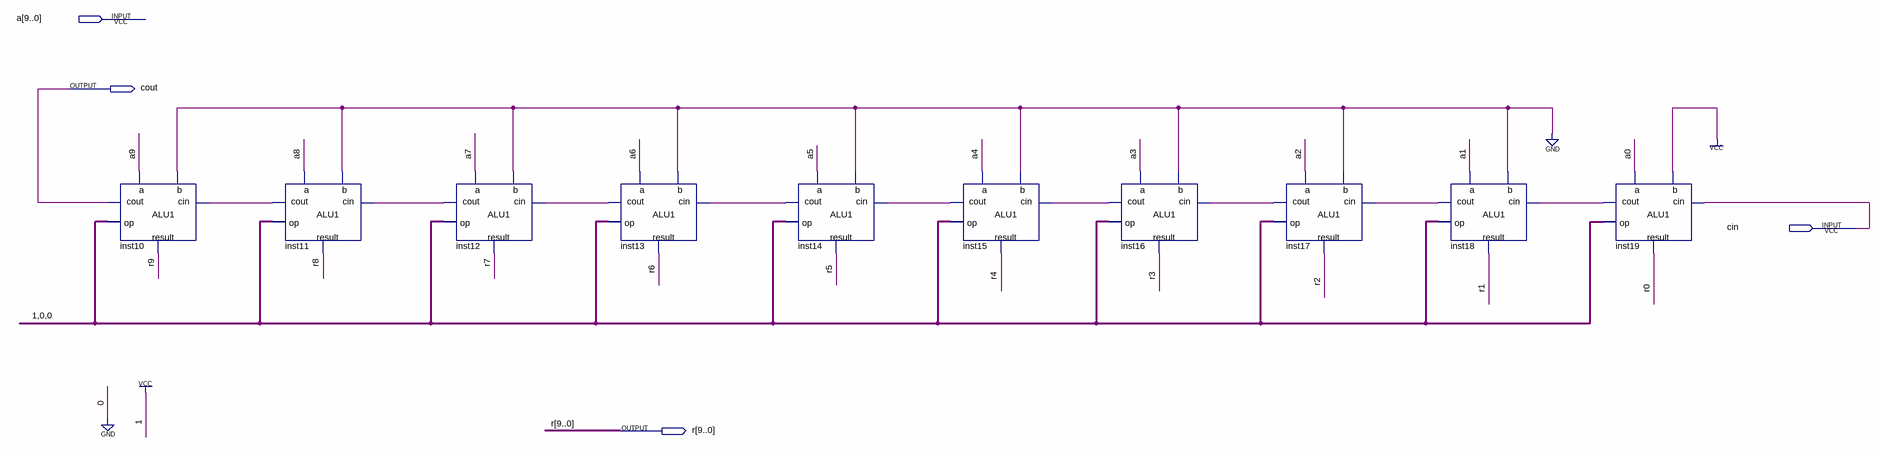
[diagram p0: schematic sheet]
// Quartus schematic inc10.bdf as structural Verilog: 10 symbols, 4 pins
module inc10 (
  input  [9:0] a,
  input  cin,
  output cout,
  output [9:0] r
);

  wire inst11_cout, inst12_cout, inst13_cout, inst14_cout, inst15_cout, inst16_cout, inst17_cout,
       inst18_cout, inst19_cout;

  ALU1 inst10 (.a(a[9]), .b(1'b0), .cin(inst11_cout), .op(3'b100), .cout(cout), .result(r[9]));
  ALU1 inst11 (.a(a[8]), .b(1'b0), .cin(inst12_cout), .op(3'b100), .cout(inst11_cout), .result(r[8]));
  ALU1 inst12 (.a(a[7]), .b(1'b0), .cin(inst13_cout), .op(3'b100), .cout(inst12_cout), .result(r[7]));
  ALU1 inst13 (.a(a[6]), .b(1'b0), .cin(inst14_cout), .op(3'b100), .cout(inst13_cout), .result(r[6]));
  ALU1 inst14 (.a(a[5]), .b(1'b0), .cin(inst15_cout), .op(3'b100), .cout(inst14_cout), .result(r[5]));
  ALU1 inst15 (.a(a[4]), .b(1'b0), .cin(inst16_cout), .op(3'b100), .cout(inst15_cout), .result(r[4]));
  ALU1 inst16 (.a(a[3]), .b(1'b0), .cin(inst17_cout), .op(3'b100), .cout(inst16_cout), .result(r[3]));
  ALU1 inst17 (.a(a[2]), .b(1'b0), .cin(inst18_cout), .op(3'b100), .cout(inst17_cout), .result(r[2]));
  ALU1 inst18 (.a(a[1]), .b(1'b0), .cin(inst19_cout), .op(3'b100), .cout(inst18_cout), .result(r[1]));
  ALU1 inst19 (.a(a[0]), .b(1'b1), .cin(cin), .op(3'b100), .cout(inst19_cout), .result(r[0]));
endmodule
